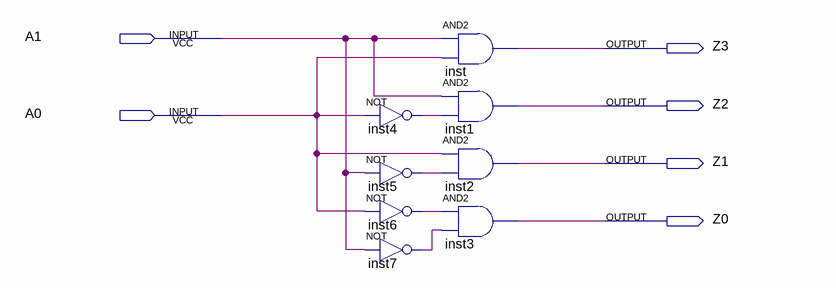
[diagram p0: schematic sheet]
// Quartus schematic Decoder_2_4.bdf as structural Verilog: 8 symbols, 6 pins
module Decoder_2_4 (
  input  A1,
  input  A0,
  output Z3,
  output Z2,
  output Z1,
  output Z0
);

  wire inst4_out, inst5_out, inst6_out, inst7_out;

  not inst4 (inst4_out, A0);
  not inst5 (inst5_out, A1);
  not inst6 (inst6_out, A0);
  not inst7 (inst7_out, A1);
  and inst (Z3, A1, A0);
  and inst1 (Z2, A1, inst4_out);
  and inst2 (Z1, A0, inst5_out);
  and inst3 (Z0, inst6_out, inst7_out);
endmodule
